# EAGLE design Heart (EAGLE 7.5.0)
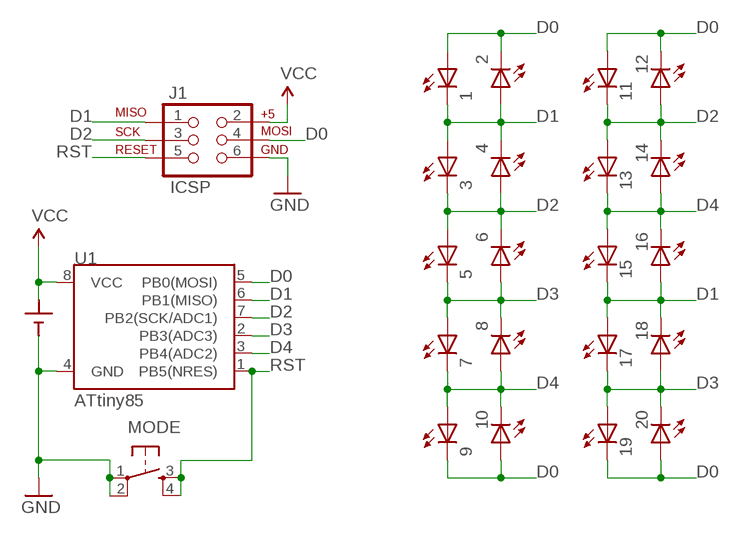
[diagram p0: schematic, sheet 1]

## Parts
1  LED5MM  [LED5MM]
2  LED5MM  [LED5MM]
3  LED5MM  [LED5MM]
4  LED5MM  [LED5MM]
5  LED5MM  [LED5MM]
6  LED5MM  [LED5MM]
7  LED5MM  [LED5MM]
8  LED5MM  [LED5MM]
9  LED5MM  [LED5MM]
10  LED5MM  [LED5MM]
11  LED5MM  [LED5MM]
12  LED5MM  [LED5MM]
13  LED5MM  [LED5MM]
14  LED5MM  [LED5MM]
15  LED5MM  [LED5MM]
16  LED5MM  [LED5MM]
17  LED5MM  [LED5MM]
18  LED5MM  [LED5MM]
19  LED5MM  [LED5MM]
20  LED5MM  [LED5MM]
BATT  CR2032  BATTCR2032_THRU  [CR2032-THRU]
J1  ICSP  AVR_SPI_PRG_6LABELED  [2X3-NS]
MODE  TAC_SWITCHPTH  [TACTILE-PTH]
U1  ATtiny85  ATTINY45TINY85-20-DIP  [DIP08]

## Nets
D0: 1.A 2.K(C) 9.K(C) 10.A 11.A 12.K(C) 19.K(C) 20.A J1.4(MOSI) U1.5(PB0(MOSI))
D1: 1.K(C) 2.A 3.A 4.K(C) 15.K(C) 16.A 17.A 18.K(C) J1.1(MISO) U1.6(PB1(MISO))
D2: 3.K(C) 4.A 5.A 6.K(C) 11.K(C) 12.A 13.A 14.K(C) J1.3(SCK) U1.7(PB2(SCK/ADC1))
D3: 5.K(C) 6.A 7.A 8.K(C) 17.K(C) 18.A 19.A 20.K(C) U1.2(PB3(ADC3))
D4: 7.K(C) 8.A 9.A 10.K(C) 13.K(C) 14.A 15.A 16.K(C) U1.3(PB4(ADC2))
GND: BATT.- J1.6(GND) MODE.1 MODE.2 U1.4(GND)
RST: J1.5(RST) MODE.3 MODE.4 U1.1(PB5(NRES))
VCC: BATT.+1(+) J1.2(V+) U1.8(VCC)

## Library data of the parts
1-20 = barbary_enterprises:LED: LEDs Standard schematic elements and footprints for 5mm, 3mm, 1206, and 0603 sized LEDs. 5mm - Spark Fun Electronics SKU : COM-00529 (and others)
BATT = battery:BATT
J1 = barbary_enterprises:AVR_SPI_PRG_6: AVR ISP 6 Pin This is the reduced ISP connector for AVR programming. Common on Arduino. This footprint will take up less PCB space and can be used with a 10-pin to 6-pin adapter such as SKU: BOB-08508
MODE = barbary_enterprises:TAC_SWITCH: Momentary Switch Button commonly used for reset or general input. Spark Fun Electronics SKU : COM-00097 SMT- SWCH-08247
U1 = SparkFun-DigitalIC:ATTINY45: Atmel 8-pin 2/4/8kB flash uC; PROD_ID: IC-09445; VALUE: TINY85-20-DIP

## Board
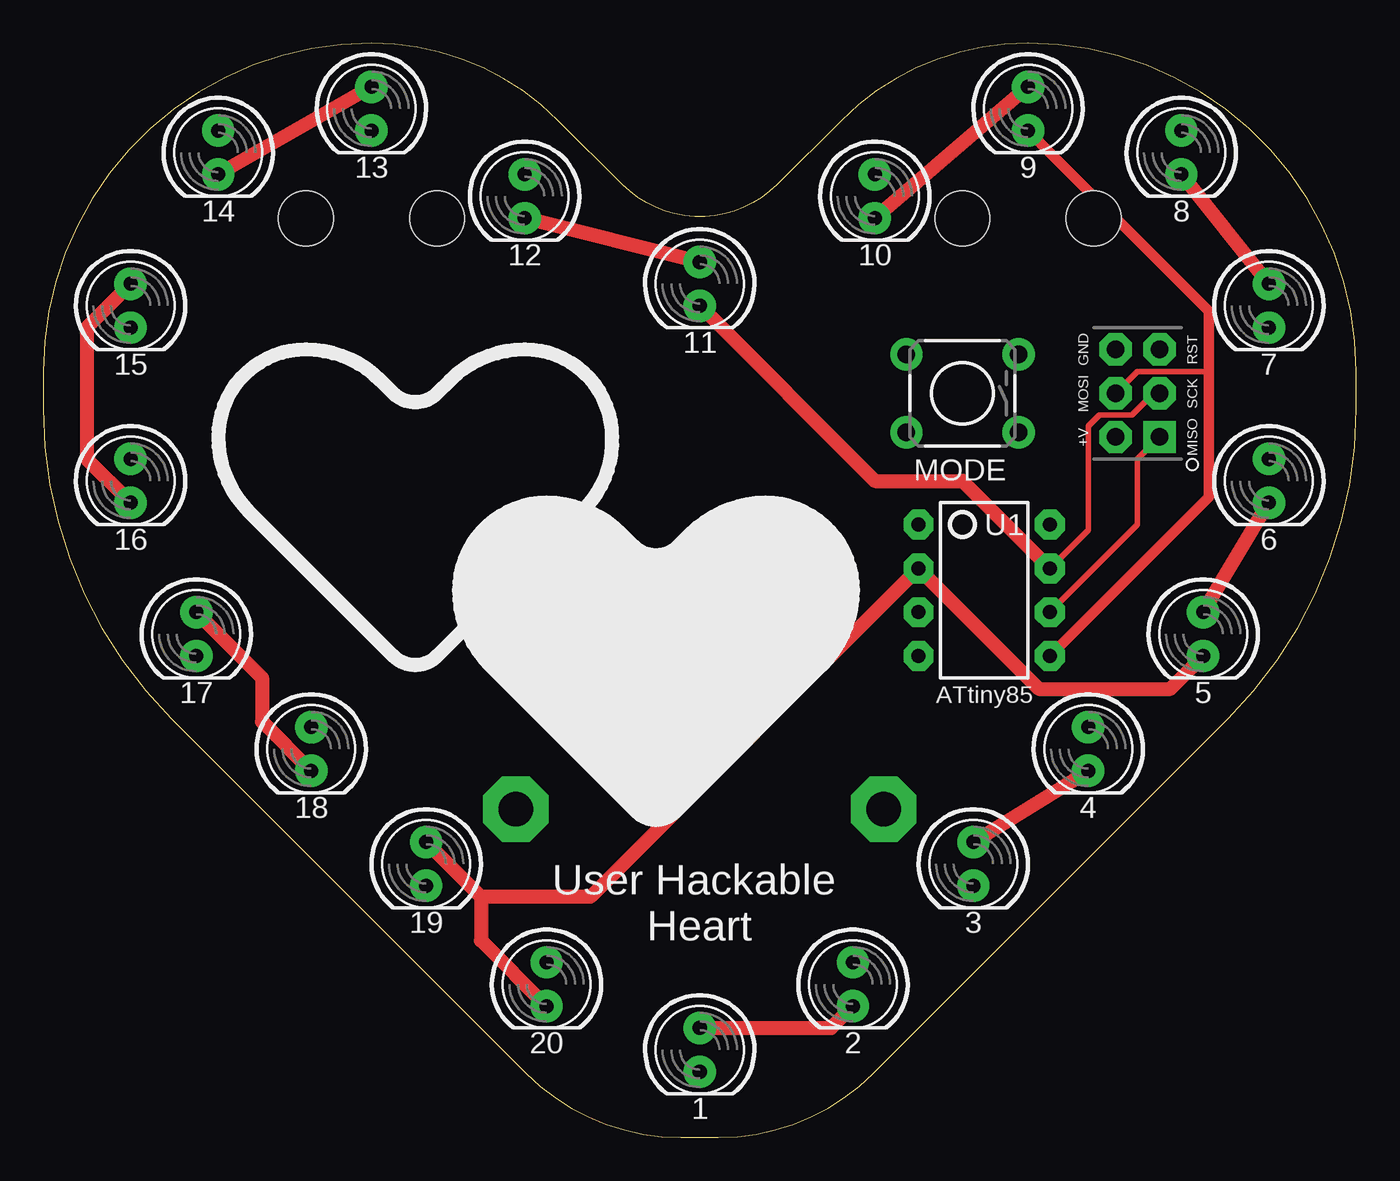
[diagram p1: board, top side]
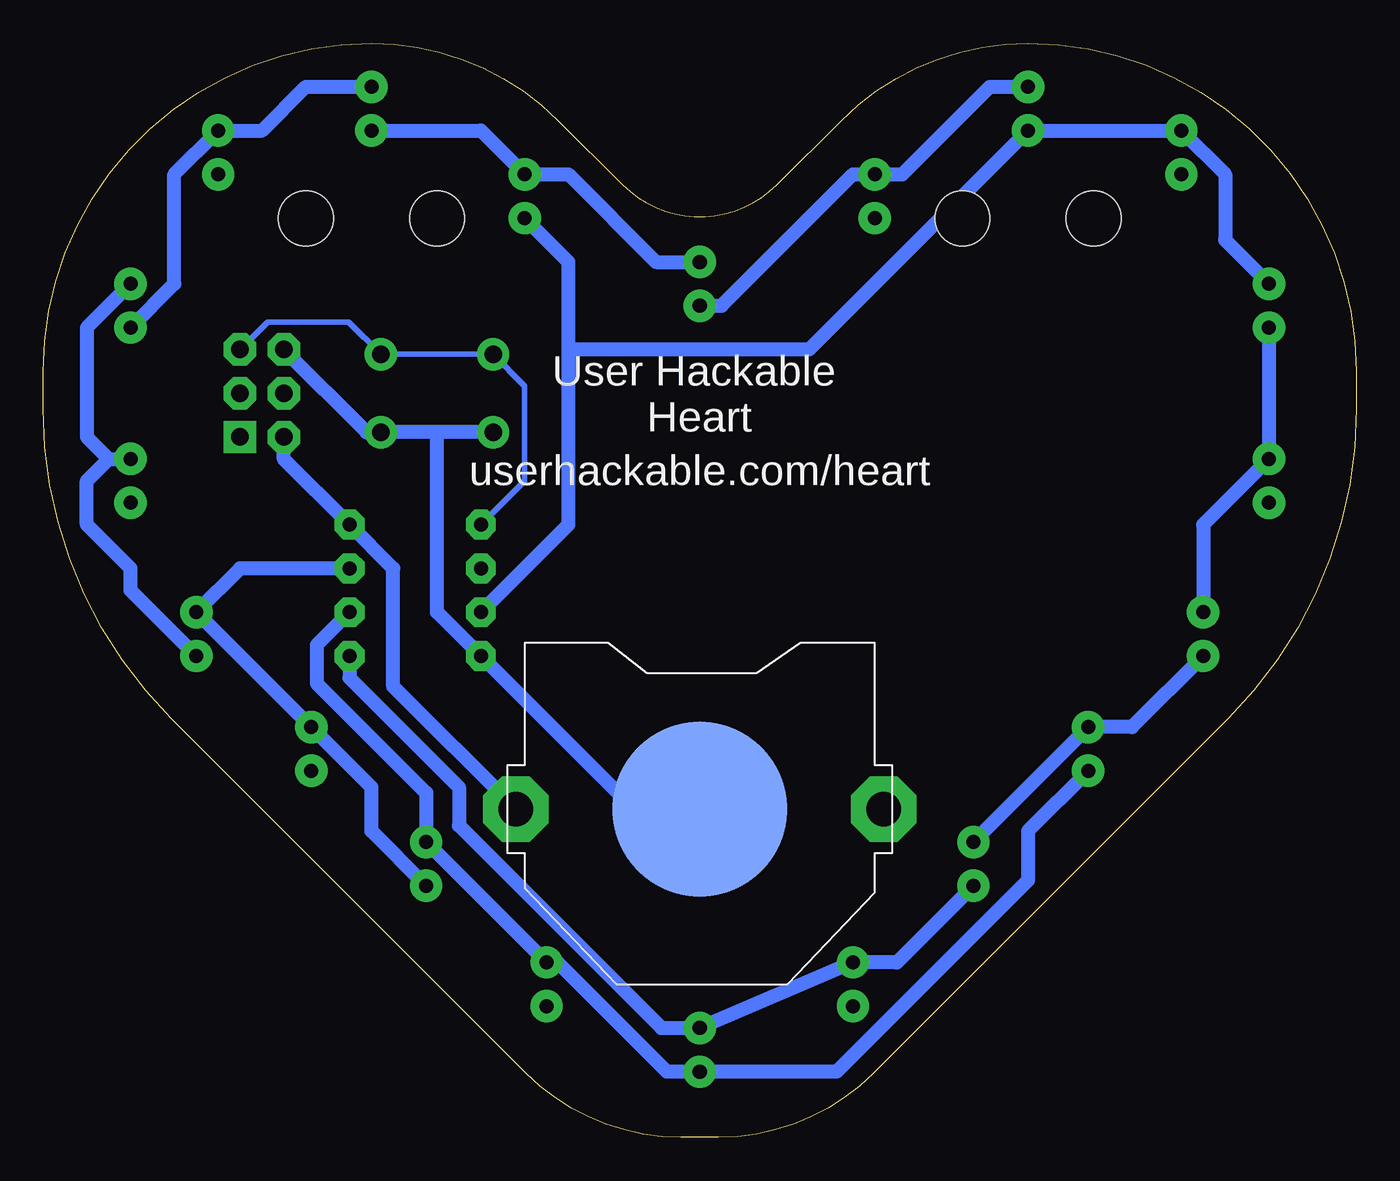
[diagram p2: board, bottom side, seen from below]

Size 76.2 x 63.5 mm. Coordinates in mm from the lower left corner, seen from the top.
Outline: 33.61,55.29 29.89,59.01 arc45 19.05,63.5 arc90 0,44.45 0,42.27 arc45 7.44,24.31 28.03,3.72 arc45 37.01,0 39.19,0 arc45 48.17,3.72 68.76,24.31 arc45 76.2,42.27 76.2,44.45 arc90 57.15,63.5 arc45 46.31,59.01 42.59,55.29 arc-90 33.61,55.29
Copper layers (1*16): Top 0.0356mm / dielectric 1.5011mm / Bottom 0.0356mm
Design rules "LaenPCBOrder": minimum track width 6mil, minimum drill 13mil, track to track 6mil, track to pad 6mil, pad to pad 6mil, via to via 6mil, smd to smd 6mil, copper to edge 15mil, drill to drill 6mil, minimum pad ring 7mil, minimum via ring 7mil, stop-mask expansion 3mil, vias tented up to drill 0mil, thermal gap 10mil
Holes 3.17 mm at 15.24,53.34 60.96,53.34 22.86,53.34 53.34,53.34

### Footprints (pad centres in the part's own frame; a part is rotated, then mirrored left to right if it is on the bottom)
LED5MM = drill 0.813 pad 1.88: A -1.27,0; K 1.27,0
CR2032-THRU = drill 2 pad 3.81 octagon: +1 -10.668,0; +2 10.668,0 | smd 10.16 x 10.16: - 0,0
2X3-NS = drill 1.016 pad 1.88 square: 1 -2.54,-1.27 | drill 1.016 pad 1.88 octagon: 2 -2.54,1.27; 3 0,-1.27; 4 0,1.27; 5 2.54,-1.27; 6 2.54,1.27
TACTILE-PTH = drill 1.016 pad 1.88: 1 -3.251,2.261; 2 3.251,2.261; 3 -3.251,-2.261; 4 3.251,-2.261
DIP08 = drill 0.813 pad 1.727 octagon: 1 -3.81,-3.81; 2 -1.27,-3.81; 3 1.27,-3.81; 4 3.81,-3.81; 5 3.81,3.81; 6 1.27,3.81; 7 -1.27,3.81; 8 -3.81,3.81

### Placement (x,y rotation side)
1  38.1,5.08 270 top
2  46.99,8.89 270 top
3  53.98,15.88 270 top
4  60.64,22.54 270 top
5  67.31,29.21 270 top
6  71.12,38.1 270 top
7  71.12,48.26 270 top
8  66.04,57.15 270 top
9  57.15,59.69 270 top
10  48.26,54.61 270 top
11  38.1,49.53 270 top
12  27.94,54.61 270 top
13  19.05,59.69 270 top
14  10.16,57.15 270 top
15  5.08,48.26 270 top
16  5.08,38.1 270 top
17  8.89,29.21 270 top
18  15.56,22.54 270 top
19  22.23,15.88 270 top
20  29.21,8.89 270 top
BATT  38.1,19.05 0 bottom
J1  63.5,43.18 90 top
MODE  53.34,43.18 180 top
U1  54.61,31.75 270 top

### Tracks (layer width: path | path; a pad name or v marks a point on that pad's centre or on a via)
D0
  Top 0.305: J1.4 63.5,44.45 67.63,44.45
  Top 0.61: U1.5 67.63,37.15 67.63,44.45 67.63,47.94 9.K
  Top 0.813: 11.A 12.K | 1.A 45.72,6.35 2.K
  Bottom 0.813: 9.K 50.8,58.42 10.A 45.72,55.88 40.64,50.8 11.A | 19.K 26.67,10.16 20.A 1.A 40.32,6.35 52.07,18.1 52.07,20.32 58.42,26.67 U1.5
D1
  Top 0.305: U1.6 63.5,35.56 63.5,39.37 J1.1
  Top 0.813: 3.A 4.K | 17.A 12.7,26.67 12.7,24.13 18.K
  Bottom 0.813: 15.K 16.A 8.89,35.56 17.A | U1.6 60.33,28.57 60.33,26.35 53.98,20 3.A 2.A 46.35,10.16 40.01,3.81 1.K 30.16,3.81 19.05,14.92 19.05,17.78 18.K
D2
  Top 0.305: J1.3 64.45,43.18 63.18,41.91 61.28,41.91 60.64,41.27 60.64,35.24 U1.7
  Top 0.813: 5.A 6.K | 13.A 14.K | 11.K 48.26,38.1 53.34,38.1 U1.7
  Bottom 0.813: 3.K 57.15,17.78 57.15,20.32 4.A 5.A 64.77,33.02 U1.7 | 11.K 36.83,48.26 29.21,55.88 12.A 26.35,55.88 21.27,60.96 13.A
D3
  Top 0.813: 7.A 8.K | 19.A 25.4,13.97 | 25.4,13.97 25.4,11.43 20.K | 5.K 65.41,26.04 57.78,26.04 U1.2 31.75,13.97 25.4,13.97
  Bottom 0.813: 5.K 71.12,31.75 71.12,33.02 73.66,35.56 73.66,38.1 72.39,39.37 | 72.39,39.37 6.A | 7.A 73.66,46.99 73.66,40.64 72.39,39.37 | 17.K 13.02,23.81 18.A 19.A
D4
  Top 0.813: 9.A 10.K | 15.A 2.54,46.99 2.54,39.37 16.K
  Bottom 0.813: 7.K 68.58,49.53 68.58,55.88 8.A 63.5,58.42 60.96,60.96 9.A | 15.A 7.62,52.07 7.62,55.88 14.A 13.K 31.75,45.72 45.72,45.72 | U1.3 45.72,35.56 45.72,45.72 | 45.72,45.72 45.72,50.8 10.K
GND
  Bottom 0.813: BATT.- 41.91,19.05 U1.4 53.34,30.48 53.34,40.92 | MODE.2 53.34,40.92 | 53.34,40.92 MODE.1 57.43,40.92 J1.6
RST
  Bottom 0.305: J1.5 63.18,47.31 58.46,47.31 MODE.3 MODE.4 48.26,43.61 48.26,38.1 U1.1
VCC
  Bottom 0.813: BATT.+1 55.88,26.16 55.88,33.02 U1.8 62.23,39.37 J1.2

### Text on the board
tPlace: User Hackable / Heart
bPlace: User Hackable / Heart | userhackable.com/heart